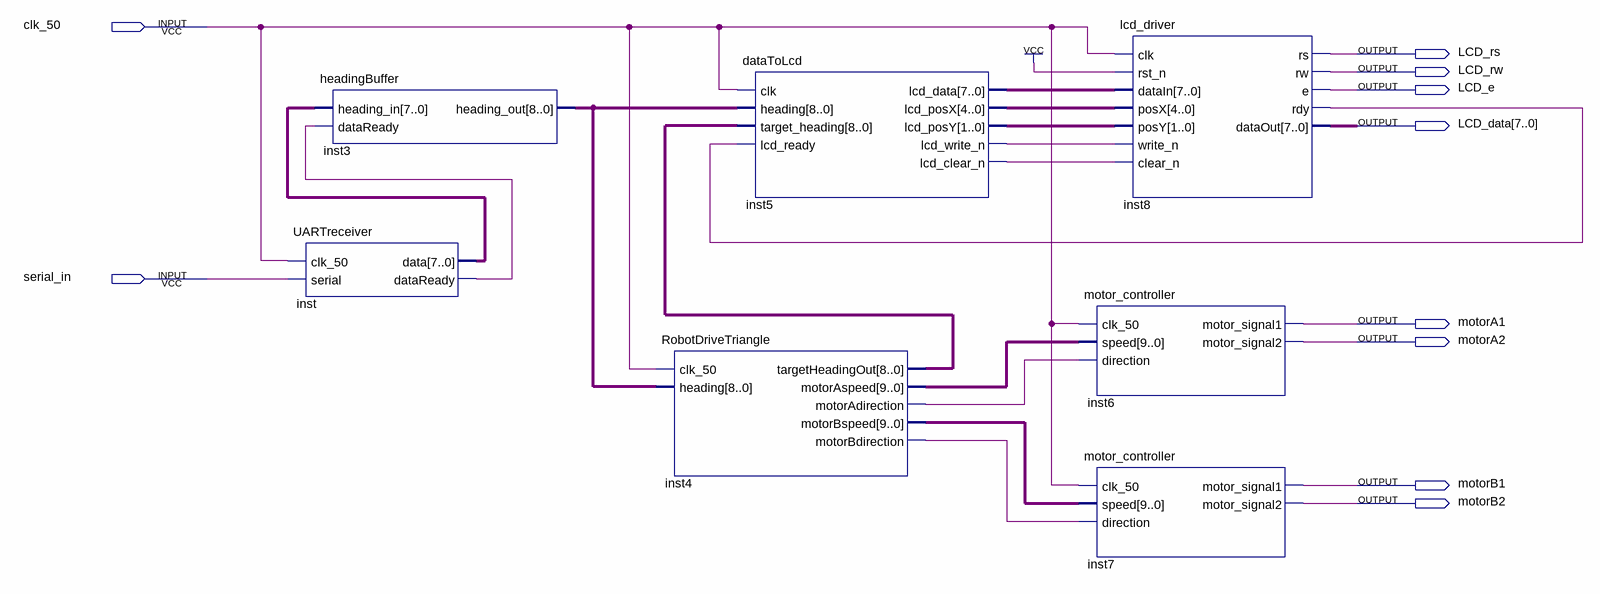
[diagram p0: schematic sheet]
// Quartus schematic UARTreader.bdf as structural Verilog: 7 symbols, 10 pins
module UARTreader (
  input  clk_50,
  input  serial_in,
  output LCD_rs,
  output LCD_rw,
  output LCD_e,
  output [7:0] LCD_data,
  output motorA1,
  output motorA2,
  output motorB1,
  output motorB2
);

  wire inst4_motoradirection, inst4_motorbdirection, inst5_lcd_clear_n, inst5_lcd_write_n, inst8_rdy,
       inst_dataready;
  wire [1:0] inst5_lcd_posy;
  wire [4:0] inst5_lcd_posx;
  wire [7:0] inst5_lcd_data, inst_data;
  wire [8:0] inst3_heading_out, inst4_targetheadingout;
  wire [9:0] inst4_motoraspeed, inst4_motorbspeed;

  UARTreceiver inst (.clk_50(clk_50), .serial(serial_in), .data(inst_data), .dataReady(inst_dataready));
  headingBuffer inst3 (.heading_in(inst_data), .dataReady(inst_dataready), .heading_out(inst3_heading_out));
  RobotDriveTriangle inst4 (
    .clk_50(clk_50), .heading(inst3_heading_out), .targetHeadingOut(inst4_targetheadingout),
    .motorAspeed(inst4_motoraspeed), .motorAdirection(inst4_motoradirection),
    .motorBspeed(inst4_motorbspeed), .motorBdirection(inst4_motorbdirection));
  dataToLcd inst5 (
    .clk(clk_50), .heading(inst3_heading_out), .target_heading(inst4_targetheadingout),
    .lcd_ready(inst8_rdy), .lcd_data(inst5_lcd_data), .lcd_posX(inst5_lcd_posx), .lcd_posY(inst5_lcd_posy),
    .lcd_write_n(inst5_lcd_write_n), .lcd_clear_n(inst5_lcd_clear_n));
  motor_controller inst6 (
    .clk_50(clk_50), .speed(inst4_motoraspeed), .direction(inst4_motoradirection), .motor_signal1(motorA1),
    .motor_signal2(motorA2));
  motor_controller inst7 (
    .clk_50(clk_50), .speed(inst4_motorbspeed), .direction(inst4_motorbdirection), .motor_signal1(motorB1),
    .motor_signal2(motorB2));
  lcd_driver inst8 (
    .clk(clk_50), .rst_n(1'b1), .dataIn(inst5_lcd_data), .posX(inst5_lcd_posx), .posY(inst5_lcd_posy),
    .write_n(inst5_lcd_write_n), .clear_n(inst5_lcd_clear_n), .rs(LCD_rs), .rw(LCD_rw), .e(LCD_e),
    .rdy(inst8_rdy), .dataOut(LCD_data));
endmodule
